# EAGLE schematic DynamicBloodFlowSimulator_v1.0 (EAGLE 7.1.0)
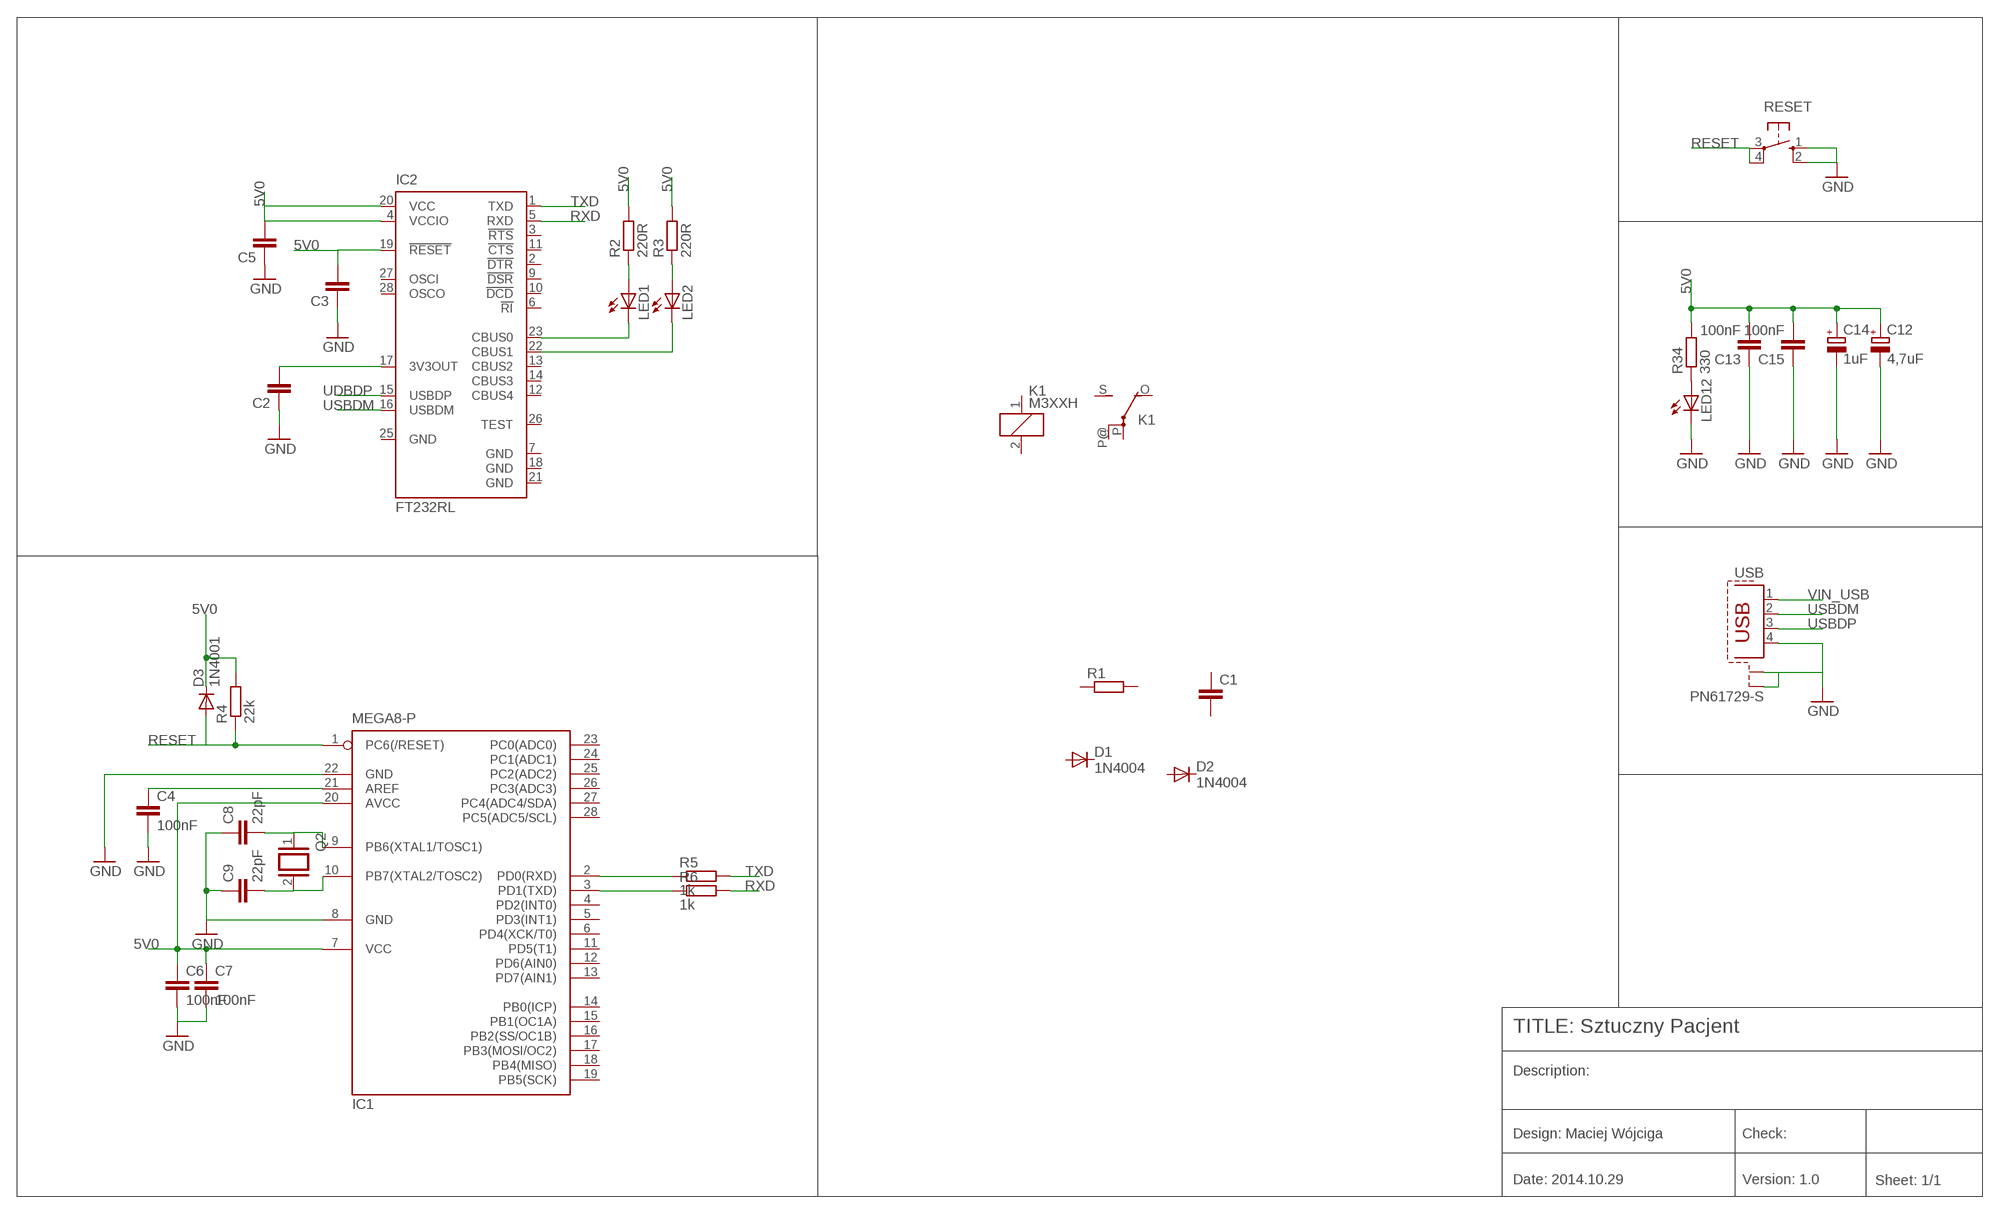
[diagram p0: schematic, sheet 1]

## Parts
C1  C-EU025-025X050  [C025-025X050]
C2  C-EU025-025X050  [C025-025X050]
C3  C-EU025-025X050  [C025-025X050]
C4  100nF  C-EUC0805  [C0805]
C5  C-EU025-025X050  [C025-025X050]
C6  100nF  C-EU025-025X050  [C025-025X050]
C7  100nF  C-EU025-025X050  [C025-025X050]
C8  22pF  C-EU025-025X050  [C025-025X050]
C9  22pF  C-EU025-025X050  [C025-025X050]
C12  4,7uF  CPOL-EUE2.5-5  [E2,5-5]
C13  100nF  C-EU025-025X050  [C025-025X050]
C14  1uF  CPOL-EUE2.5-5  [E2,5-5]
C15  100nF  C-EU025-025X050  [C025-025X050]
D1  1N4004  [DO41-10]
D2  1N4004  [DO41-10]
D3  1N4001  1N4004  [DO41-10]
IC1  MEGA8-P  [DIL28-3]
IC2  FT232RL  [SSOP28]
K1  M3XXH  [M3XXH]
LED1  LED3MM  [LED3MM]
LED2  LED3MM  [LED3MM]
LED12  LED3MM  [LED3MM]
Q2  XTAL/S  [QS]
R1  R-EU_0207/10  [0207/10]
R2  220R  R-EU_0207/10  [0207/10]
R3  220R  R-EU_0207/10  [0207/10]
R4  22k  R-EU_0207/10  [0207/10]
R5  1k  R-EU_0207/10  [0207/10]
R6  1k  R-EU_0207/10  [0207/10]
R34  330  R-EU_0207/10  [0207/10]
RESET  10-XX  [B3F-10XX]
USB  PN61729-S  [PN61729-S]

## Nets
5V0: C3.2 C5.2 C6.1 C7.1 C12.+ C13.2 C14.+ C15.2 D3.C IC1.7(VCC) IC1.20(AVCC) IC2.4(VCCIO) IC2.19(!RESET) IC2.20(VCC) R2.2 R3.2 R4.2 R34.2
GND: C2.1 C3.1 C4.2 C5.1 C6.2 C7.2 C8.1 C9.1 C12.- C13.1 C14.- C15.1 IC1.8(GND) IC1.22(GND) LED12.K(C) RESET.1(S) RESET.2(S1) USB.4 USB.S1 USB.S2
N$3: C2.2 IC2.17(3V3OUT)
N$4: LED1.A R2.1
N$5: IC2.23(CBUS0) LED1.K(C)
N$6: IC2.22(CBUS1) LED2.K(C)
N$9: LED2.A R3.1
N$10: C4.1 IC1.21(AREF)
N$25: IC1.2(PD0(RXD)) R5.1
N$26: IC1.3(PD1(TXD)) R6.1
N$29: C8.2 IC1.9(PB6(XTAL1/TOSC1)) Q2.1
N$35: C9.2 IC1.10(PB7(XTAL2/TOSC2)) Q2.2
N$51: LED12.A R34.1
RESET: D3.A IC1.1(PC6(/RESET)) R4.1 RESET.3(P) RESET.4(P1)
RXD: IC2.5(RXD) R6.2
TXD: IC2.1(TXD) R5.2
UDBDP: IC2.15(USBDP)
USBDM: IC2.16(USBDM) USB.2
USBDP: USB.3
VIN_USB: USB.1
Unconnected: C1.1 C1.2 D1.A D1.C D2.A D2.C IC1.4(PD2(INT0)) IC1.5(PD3(INT1)) IC1.6(PD4(XCK/T0)) IC1.11(PD5(T1)) IC1.12(PD6(AIN0)) IC1.13(PD7(AIN1)) IC1.14(PB0(ICP)) IC1.15(PB1(OC1A)) IC1.16(PB2(SS/OC1B)) IC1.17(PB3(MOSI/OC2)) IC1.18(PB4(MISO)) IC1.19(PB5(SCK)) IC1.23(PC0(ADC0)) IC1.24(PC1(ADC1)) IC1.25(PC2(ADC2)) IC1.26(PC3(ADC3)) IC1.27(PC4(ADC4/SDA)) IC1.28(PC5(ADC5/SCL)) IC2.2(!DTR) IC2.3(!RTS) IC2.6(!RI) IC2.9(!DSR) IC2.10(!DCD) IC2.11(!CTS) IC2.12(CBUS4) IC2.13(CBUS2) IC2.14(CBUS3) IC2.26(TEST) IC2.27(OSCI) IC2.28(OSCO) K1.1 K1.2 K1.O(2:O) K1.P(2:P) K1.P@(2:P) K1.S(2:S) R1.1 R1.2

## Notes on the sheet
- TITLE: Sztuczny Pacjent
- Description:
- Design: Maciej Wójciga | Check:
- Date: 2014.10.29 | Version: 1.0 | Sheet: 1/1

## Power pins joined to a net without a drawn wire
GND: IC2.7(GND) IC2.18(GND) IC2.21(GND) IC2.25(GND)

## Library data of the parts
C1-C9 C13 C15 = rcl:C-EU: CAPACITOR, European symbol
C12 C14 = rcl:CPOL-EU: POLARIZED CAPACITOR, European symbol
D1-D3 = diode:1N4004: DIODE general purpose rectifier, 1 A
IC1 = atmel:MEGA8-P: MICROCONTROLLER 8 Kbytes FLASH, 1 kbytes SRAM, 512 bytes EEPROM, USART, 4-channel 10 bit ADC, 2-channel 8 bit ADC Pin compatible with Atmega48, ATMega88, ATMega168 Source: avr.lbr; OC_FARNELL: unknown; OC_NEWARK: unknown
IC2 = ftdichip:FT232R: Source: http://www.ftdichip.com/Documents/DataSheets/DS_FT232R_v104.pdf; MPN: FT232RL; OC_FARNELL: 1146032; OC_NEWARK: 91K9918
K1 = relay:M3XXH: RELAY 1 x switch; OC_FARNELL: unknown; OC_NEWARK: unknown
LED1 LED2 LED12 = led:LED: LED OSRAM: - CHIPLED LG R971, LG N971, LY N971, LG Q971, LY Q971, LO R971, LY R971 LH N974, LH R974 LS Q976, LO Q976, LY Q976 LO Q996 - Hyper CHIPLED LW Q18S LB Q993, LB Q99A, LB R99A - SideLED LS A670, LO A670, LY A670, LG A670, LP A670 LB A673, LV A673, LT A673, LW A673 LH A674 LY A675 LS A676, LA A676, LO A676, LY A676, LW A676 LS A679, LY A679, LG A679 - Hyper Micro SIDELED® LS Y876, LA Y876, LO Y876, LY Y876 LT Y87S - SmartLED LW L88C, LW L88S LB L89C, LB L89S, LG L890 LS L89K, LO L89K, LY L89K LS L896, LA L896, LO L896, LY L896 - TOPLED LS T670, LO T670, LY T670, LG T670, LP T670 LSG T670, LSP T670, LSY T670, LOP T670, LYG T670 LG T671, LOG T671, LSG T671 LB T673, LV T673, LT T673, LW T673 LH T674 LS T676, LA T676, LO T676, LY T676, LB T676, LH T676, LSB T676, LW T676 LB T67C, LV T67C, LT T67C, LS T67K, LO T67K, LY T67K, LW E67C LS E67B, LA E67B, LO E67B, LY E67B, LB E67C, LV E67C, LT E67C LW T67C LS T679, LY T679, LG T679 LS T770, LO T770, LY T770, LG T770, LP T770 LB T773, LV T773, LT T773, LW T773 LH T774 LS E675, LA E675, LY E675, LS T675 LS T776, LA T776, LO T776, LY T776, LB T776 LHGB T686 LT T68C, LB T68C - Hyper Mini TOPLED® LB M676 - Mini TOPLED Santana® LG M470 LS M47K, LO M47K, LY M47K Source: http://www.osram.convergy.de LUXEON: - LUMILED® LXK2-PW12-R00, LXK2-PW12-S00, LXK2-PW14-U00, LXK2-PW14-V00 LXK2-PM12-R00, LXK2-PM12-S00, LXK2-PM14-U00 LXK2-PE12-Q00, LXK2-PE12-R00, LXK2-PE12-S00, LXK2-PE14-T00, LXK2-PE14-U00 LXK2-PB12-K00, LXK2-PB12-L00, LXK2-PB12-M00, LXK2-PB14-N00, LXK2-PB14-P00, LXK2-PB14-Q00 LXK2-PR12-L00, LXK2-PR12-M00, LXK2-PR14-Q00, LXK2-PR14-R00 LXK2-PD12-Q00, LXK2-PD12-R00, LXK2-PD12-S00 LXK2-PH12-R00, LXK2-PH12-S00 LXK2-PL12-P00, LXK2-PL12-Q00, LXK2-PL12-R00 Source: www.luxeon.com KINGBRIGHT: KA-3528ASYC Source: www.kingbright.com
Q2 = special:XTAL/S: CRYSTAL
R1-R6 R34 = rcl:R-EU_: RESISTOR, European symbol
RESET = switch-omron:10-XX: OMRON SWITCH; MPN: B3F-1000; OC_FARNELL: 176432; OC_NEWARK: 36M3542
USB = con-berg:PN61729-S: BERG USB connector; OC_FARNELL: unknown; OC_NEWARK: unknown